# Altium schematic sheet Power Supply.SchDoc
size 420 x 297 mm; Organization: Develer s.r.l.; Address1: via Mugellese 1/A; Address2: 50019 Campi Bisenzio; Address3: Firenze; Address4: ITALY; Revision: A; SheetNumber: 1; SheetTotal: 1
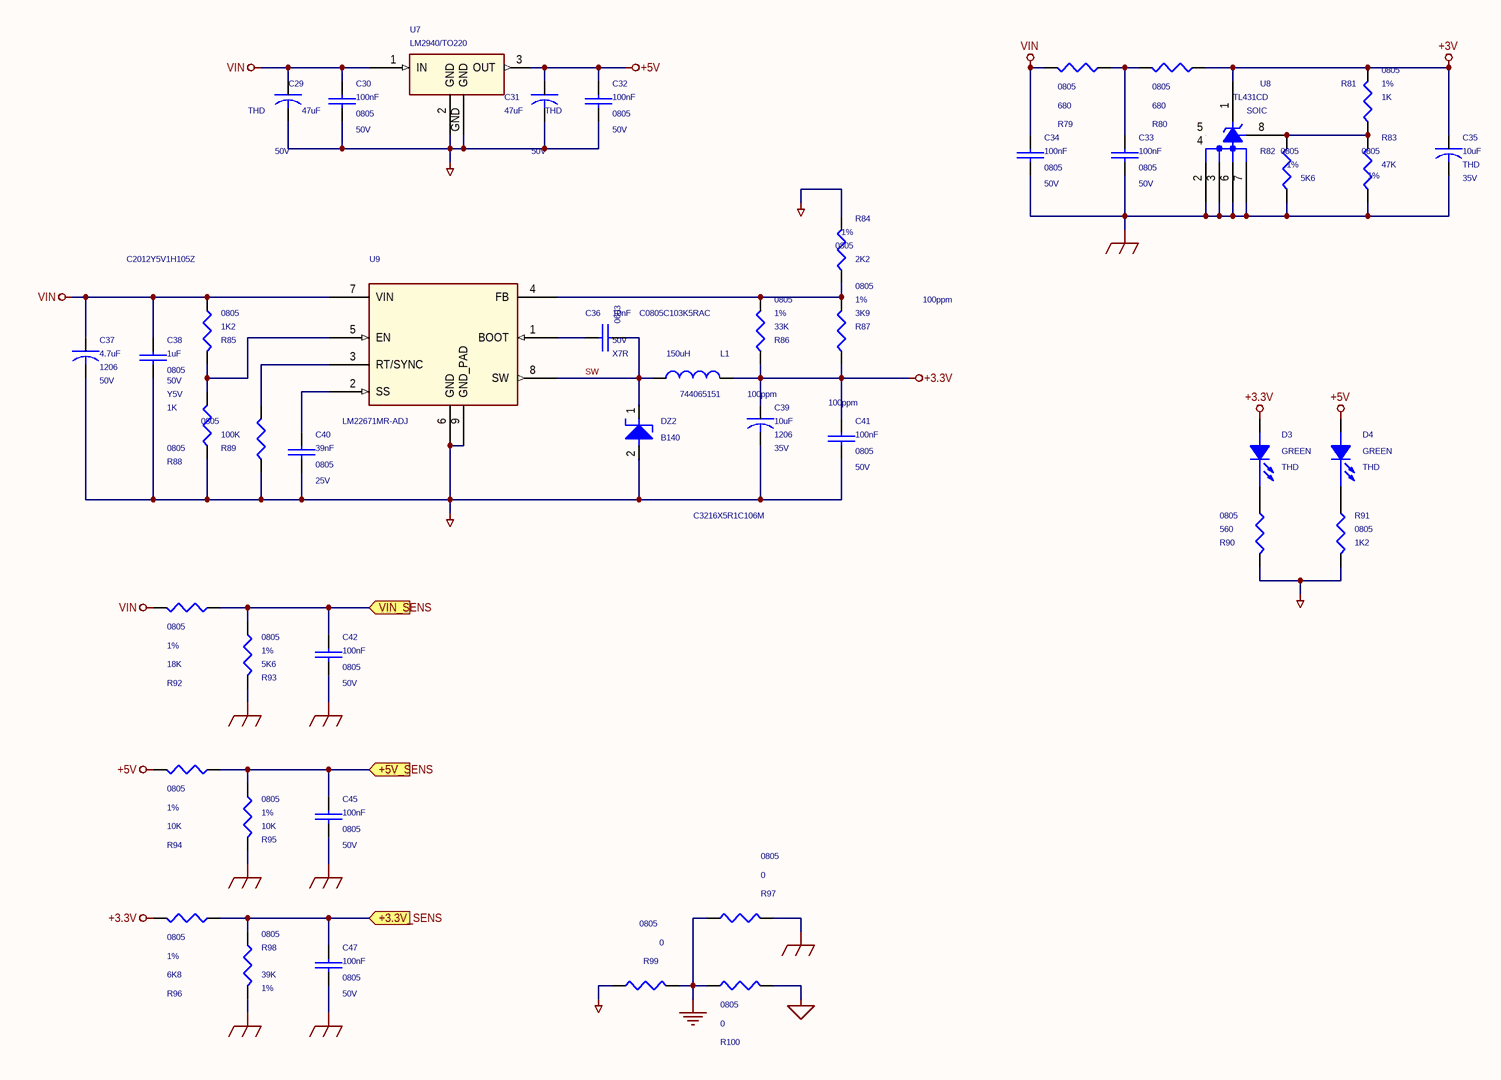
[diagram p0: Power Supply.SchDoc]

## Parts
C29  47uF  voltage: 50V  case: THD  [CPCYL1/D.250/LS.125/.031]
C30  100nF  voltage: 50V  case: 0805  [SM/C_0805]
C31  47uF  case: THD  voltage: 50V  [CPCYL1/D.250/LS.125/.031]
C32  100nF  voltage: 50V  case: 0805  [SM/C_0805]
C33  100nF  case: 0805  voltage: 50V  [SM/C_0805]
C34  100nF  case: 0805  voltage: 50V  [SM/C_0805]
C35  10uF  case: THD  voltage: 35V  [CPCYL1/D.200/LS.100/.031]
C36  10nF  case: 0603  voltage: 50V  2nd: C0805C103K5RAC  1st: X7R  [SM/C_0603]
C37  4.7uF  case: 1206  voltage: 50V  [SM/C_1206]
C38  1uF  case: 0805  voltage: 50V  2nd: C2012Y5V1H105Z  1st: Y5V  [SM/C_0805]
C39  10uF  case: 1206  voltage: 35V  2nd: C3216X5R1C106M  [SM/L_1206]
C40  39nF  voltage: 25V  case: 0805  [SM/C_0805]
C41  100nF  voltage: 50V  case: 0805  [SM/C_0805]
C42  100nF  voltage: 50V  case: 0805  [SM/C_0805]
C45  100nF  voltage: 50V  case: 0805  [SM/C_0805]
C47  100nF  voltage: 50V  case: 0805  [SM/C_0805]
D3  GREEN  case: THD  [LED/TM/R5]
D4  GREEN  case: THD  [LED/TM/R5]
DZ2  B140  [SM/DO214AC_12]
L1  150uH  1st: 744065151  [SMT/L_10X10]
R79  680  case: 0805  [SM/R_0805]
R80  680  case: 0805  [SM/R_0805]
R81  1K  case: 0805  1st: 1%  [SM/R_0805]
R82  5K6  case: 0805  1st: 1%  [SM/R_0805]
R83  47K  case: 0805  1st: 1%  [SM/R_0805]
R84  2K2  case: 0805  1st: 1%  2nd: 100ppm  [SM/R_0805]
R85  1K2  case: 0805  [SM/R_0805]
R86  33K  case: 0805  1st: 1%  2nd: 100ppm  [SM/R_0805]
R87  3K9  case: 0805  1st: 1%  2nd: 100ppm  [SM/R_0805]
R88  1K  case: 0805  [SM/R_0805]
R89  100K  case: 0805  [SM/R_0805]
R90  560  case: 0805  [SM/R_0805]
R91  1K2  case: 0805  [SM/R_0805]
R92  18K  case: 0805  1st: 1%  [SM/R_0805]
R93  5K6  case: 0805  1st: 1%  [SM/R_0805]
R94  10K  case: 0805  1st: 1%  [SM/R_0805]
R95  10K  case: 0805  1st: 1%  [SM/R_0805]
R96  6K8  case: 0805  1st: 1%  [SM/R_0805]
R97  0  case: 0805  [SM/SHORT_0805]
R98  39K  case: 0805  1st: 1%  [SM/R_0805]
R99  0  case: 0805  [SM/SHORT_0805]
R100  0  case: 0805  [SM/SHORT_0805]
U7  LM2940/TO220  [TO/TO220/3]
U8  TL431CD  case: SOIC  [SOG.050/8/WG.244/L.200]
U9  LM22671MR-ADJ  [PSOP/8]

## Ports
+3.3V_SENS (in), +5V_SENS (in), VIN_SENS (in)

## Nets
+3.3V: C39.1 C41.1 D3.1(ANODE) L1.2 R86.1 R87.1 R96.2
+3V: C35.1 R80.1 R81.2 U8.1(K)
+5V: C31.1 C32.1 D4.1(ANODE) R94.2 U7.3(OUT)
GND: R97.2 R99.2 R100.2
GND_ANALOG: C33.2 C34.2 C35.2 C42.2 C45.2 C47.2 R82.2 R83.2 R93.2 R95.2 R97.1 R98.2 U8.2(A) U8.3(A) U8.6(A) U8.7(A)
GND_DIGITAL: R100.1
GND_POWER: C29.2 C30.2 C31.2 C32.2 C37.2 C38.2 C39.2 C40.2 C41.2 DZ2.2 R84.1 R88.1 R89.2 R90.2 R91.2 R99.1 U7.2(GND) U7.GND U9.6(GND) U9.9(GND_PAD)
VIN: C29.1 C30.1 C34.1 C37.1 C38.1 R79.2 R85.1 R92.2 U7.1(IN) U9.7(VIN)
+3.3V_SENS: C47.1 R96.1 R98.1 ; port +3.3V_SENS
+5V_SENS: C45.1 R94.1 R95.1 ; port +5V_SENS
SW: C36.2 DZ2.1 L1.1 U9.8(SW)
VIN_SENS: C42.1 R92.1 R93.1 ; port VIN_SENS
NetC33_1: C33.1 R79.1 R80.2
NetC36_1: C36.1 U9.1(BOOT)
NetC40_1: C40.1 U9.2(SS)
NetD3_2: D3.2(CATHODE) R90.1
NetD4_2: D4.2(CATHODE) R91.1
NetR81_1: R81.1 R82.1 R83.1 U8.8(REF)
NetR84_2: R84.2 R86.2 R87.2 U9.4(FB)
NetR85_2: R85.2 R88.2 U9.5(EN)
NetR89_1: R89.1 U9.3(RT/SYNC)

Not connected (* = marked no-connect by the designer): U8 4(NC) 5(NC)

## Notes on the sheet
- Title:
- Size:
- Rev:
- A3
- Author:
- Approved:
- File:
- Date:
- Time:
- Sheet
- of

## Library data of the parts
C29 C31 = C_Dup3: COMPGROUP: 3
C30 C32 C40-C42 C45 C47 = C_Dup2: COMPGROUP: 3
C33 C34 C36 C38 = C_Dup1: COMPGROUP: 3
C35 C37 C39 = C_0: COMPGROUP: 3
D3 D4 = LED: COMPGROUP: 3
DZ2 = ZENER_0: COMPGROUP: 3; case: SMB
L1 = L1: COMPGROUP: 3; case: SMD
R79 R80 = R_0: 1st: 5%; COMPGROUP: 3
R81-R83 R92-R96 R98 = R_0: COMPGROUP: 3; 2nd: 100ppm
R84 R86 R87 = R_0: COMPGROUP: 3
R85 R88-R91 = R_Dup1: 1st: 5%; COMPGROUP: 3
R97 = R: 1st: 5%; COMPGROUP: 3
R99 R100 = R: COMPGROUP: 3; 1st: 5%
U7 = LM2940/TO220_1: COMPGROUP: 3; case: TO220
U8 = TL431/SO_0: COMPGROUP: 3
U9 = LM22671MR-ADJ_0: COMPGROUP: 3; case: PSOP